# EAGLE schematic LFO-Complex (EAGLE 9.0.0)
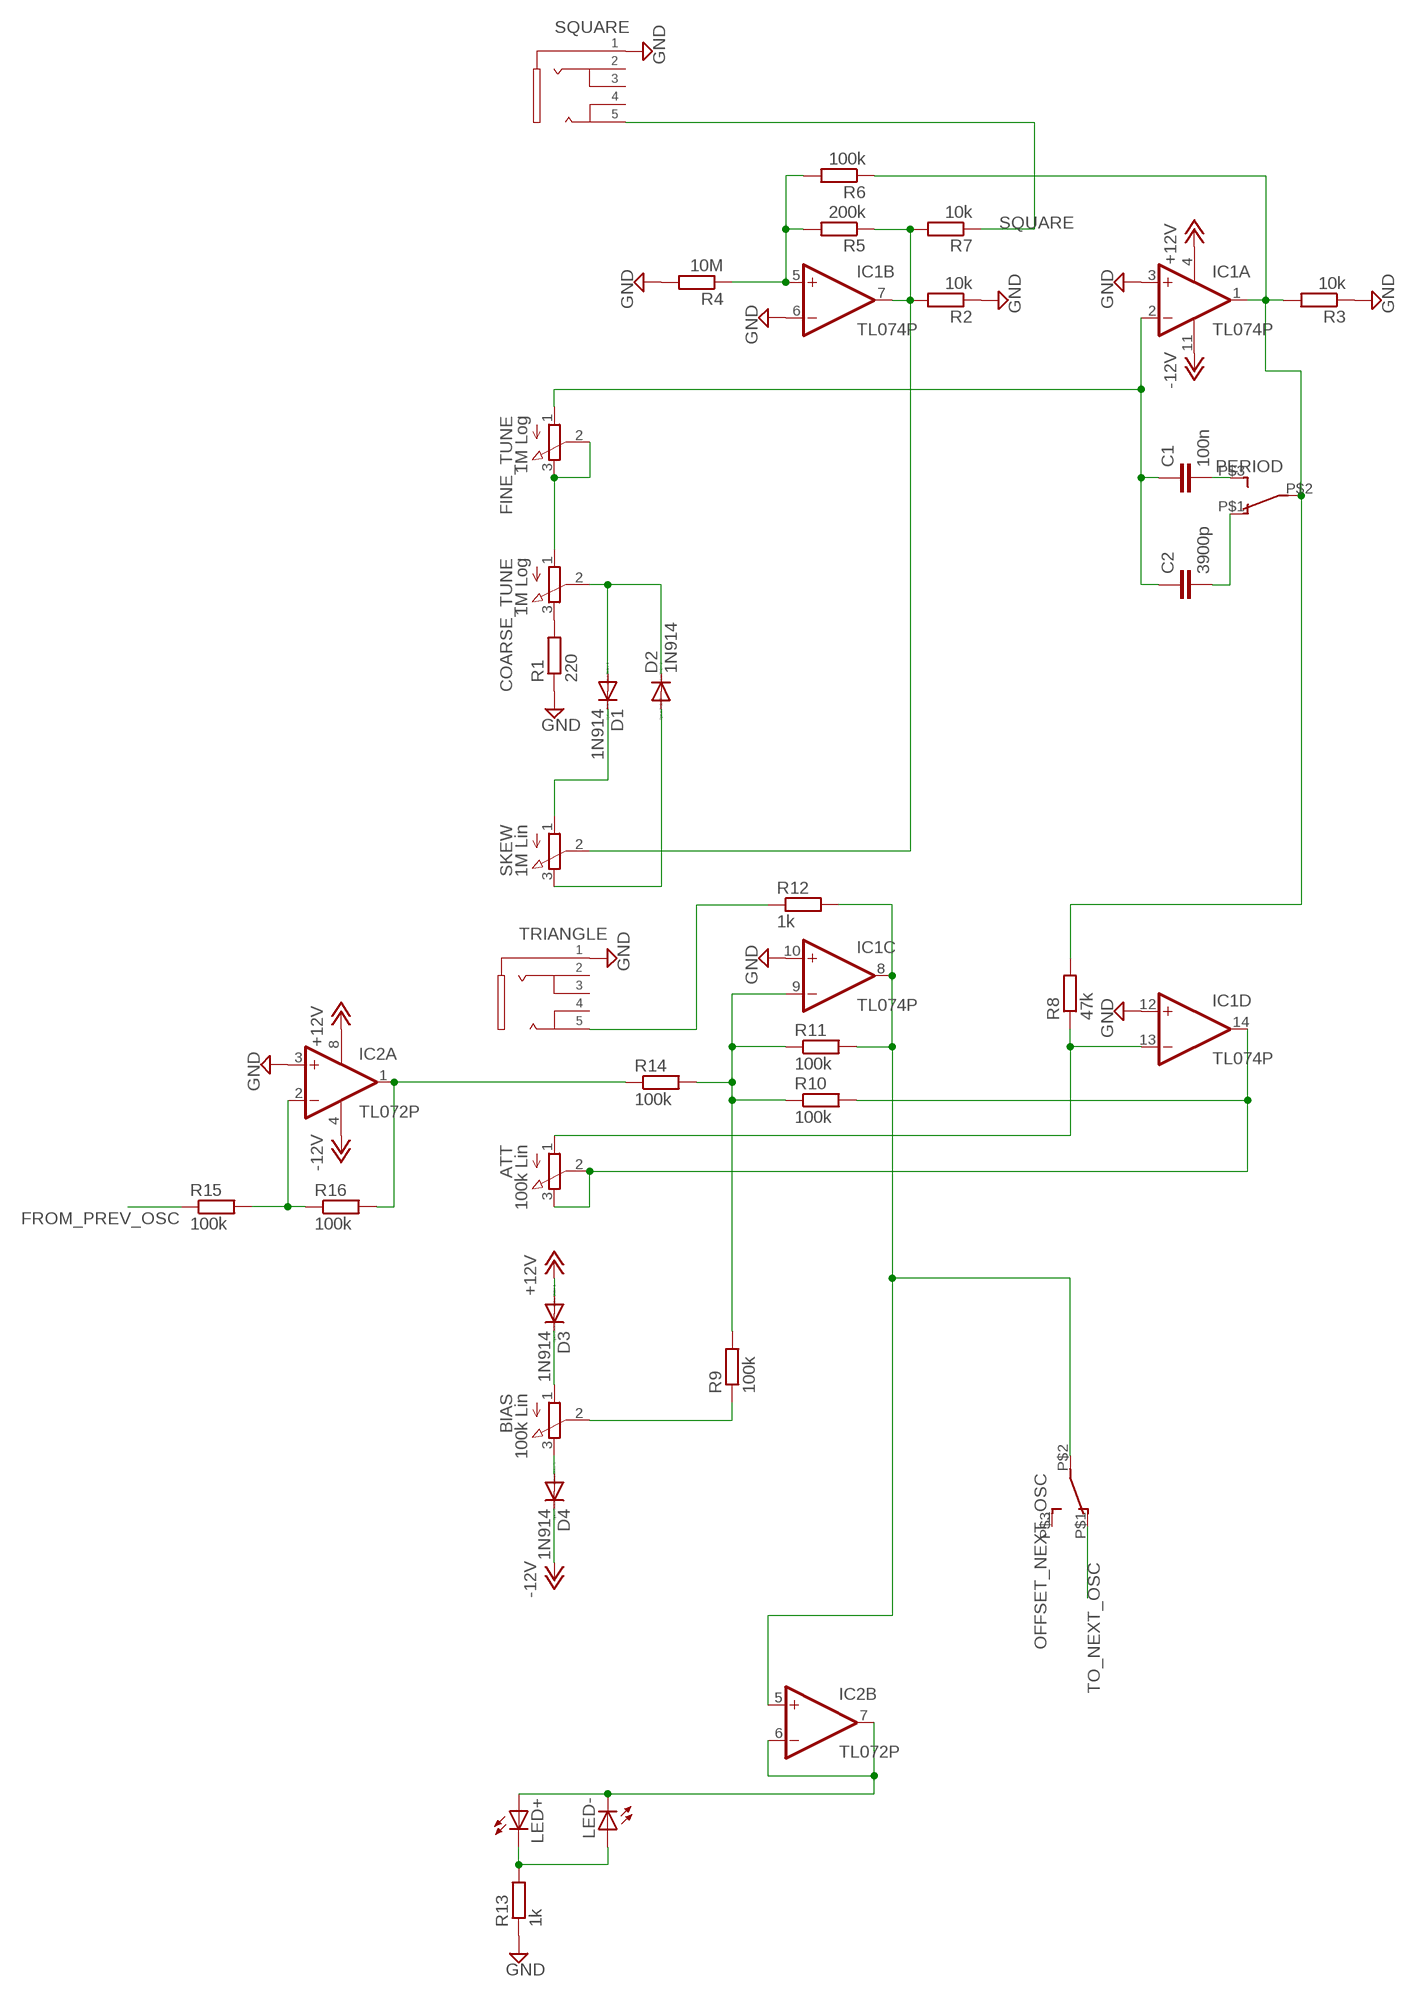
[diagram p0: schematic, sheet 1]

## Parts
ATT  100k Lin  3RP/1610N  [3RP/1610N]
BIAS  100k Lin  3RP/1610N  [3RP/1610N]
C1  100n  C-EU050-025X075  [C050-025X075]
C2  3900p  C-EU050-025X075  [C050-025X075]
COARSE_TUNE  1M Log  3RP/1610N  [3RP/1610N]
D1  1N914  [D-6.35]
D2  1N914  [D-6.35]
D3  1N914  [D-6.35]
D4  1N914  [D-6.35]
FINE_TUNE  1M Log  3RP/1610N  [3RP/1610N]
IC1  TL074P  [DIL14]
IC2  TL072P  [DIL08]
LED+  LED3MM-NB  [LED3MM]
LED-  LED3MM-NB  [LED3MM]
OFFSET_NEXT_OSC  TOGGLE-NB-MILLED  [TOGGLE-NB-MILLED]
PERIOD  TOGGLE-NB-MILLED  [TOGGLE-NB-MILLED]
R1  220  BOX-RESISTOR  [0204/7]
R2  10k  BOX-RESISTOR  [0204/7]
R3  10k  BOX-RESISTOR  [0204/7]
R4  10M  BOX-RESISTOR  [0204/7]
R5  200k  BOX-RESISTOR  [0204/7]
R6  100k  BOX-RESISTOR  [0204/7]
R7  10k  BOX-RESISTOR  [0204/7]
R8  47k  BOX-RESISTOR  [0204/7]
R9  100k  BOX-RESISTOR  [0204/7]
R10  100k  BOX-RESISTOR  [0204/7]
R11  100k  BOX-RESISTOR  [0204/7]
R12  1k  BOX-RESISTOR  [0204/7]
R13  1k  BOX-RESISTOR  [0204/7]
R14  100k  BOX-RESISTOR  [0204/7]
R15  100k  BOX-RESISTOR  [0204/7]
R16  100k  BOX-RESISTOR  [0204/7]
SKEW  1M Lin  3RP/1610N  [3RP/1610N]
SQUARE  PJ-324MH  [PJ-324MH]
TRIANGLE  PJ-324MH  [PJ-324MH]

## Nets
+12V: D3.A IC1.4(P:V+) IC2.8(P:V+)
-12V: D4.C IC1.11(P:V-) IC2.4(P:V-)
FROM_PREV_OSC: R15.1
GND: IC1.3(A:+IN) IC1.6(B:-IN) IC1.10(C:+IN) IC1.12(D:+IN) IC2.3(A:+IN) R1.1 R2.1 R3.1 R4.2 R13.1 SQUARE.1 TRIANGLE.1
N$1: COARSE_TUNE.1(A) FINE_TUNE.2(S) FINE_TUNE.3(E)
N$2: COARSE_TUNE.3(E) R1.2
N$3: COARSE_TUNE.2(S) D1.A D2.C
N$4: D1.C SKEW.1(A)
N$5: D2.A SKEW.3(E)
N$6: BIAS.1(A) D3.C
N$7: BIAS.3(E) D4.A
N$8: IC1.7(B:OUT) R2.2 R5.1 R7.2 SKEW.2(S)
N$9: C1.1 C2.1 FINE_TUNE.1(A) IC1.2(A:-IN)
N$10: IC1.1(A:OUT) PERIOD.P$2(P) R3.2 R6.1 R8.2
N$11: IC1.5(B:+IN) R4.1 R5.2 R6.2
N$12: C1.2 PERIOD.P$3(S)
N$13: C2.2 PERIOD.P$1(O)
N$14: ATT.1(A) IC1.13(D:-IN) R8.1
N$15: ATT.2(S) ATT.3(E) IC1.14(D:OUT) R10.2
N$16: BIAS.2(S) R9.1
N$17: IC1.9(C:-IN) R9.2 R10.1 R11.1 R14.2
N$18: IC1.8(C:OUT) IC2.5(B:+IN) OFFSET_NEXT_OSC.P$2(P) R11.2 R12.2
N$19: R12.1 TRIANGLE.5
N$20: IC2.2(A:-IN) R15.2 R16.1
N$21: IC2.1(A:OUT) R14.1 R16.2
N$22: IC2.6(B:-IN) IC2.7(B:OUT) LED+.A LED-.K(C)
N$23: LED+.K(C) LED-.A R13.2
SQUARE: R7.1 SQUARE.5
TO_NEXT_OSC: OFFSET_NEXT_OSC.P$1(O)
Unconnected: OFFSET_NEXT_OSC.P$3(S) SQUARE.2 SQUARE.3 SQUARE.4 TRIANGLE.2 TRIANGLE.3 TRIANGLE.4

## Library data of the parts
ATT BIAS COARSE_TUNE FINE_TUNE SKEW = pot:3RP/1610N: 16mm Potentiometer one level Source: http://www.alphapotentiometers.net/html/16mm_pot_2.html
C1 C2 = rcl:C-EU: CAPACITOR, European symbol; SPICEPREFIX: C
D1-D4 = toggle-nb:1N914
IC1 = linear:TL074: OP AMP
IC2 = linear:TL072: OP AMP
LED+ LED- = toggle-nb:LED3MM-NB
OFFSET_NEXT_OSC PERIOD = toggle-nb:TOGGLE-NB-MILLED
R1-R16 = toggle-nb:BOX-RESISTOR
SQUARE TRIANGLE = audio-jacks:PJ-324M

## Net classes
1 power: width 1.016 mm, clearance 0.203 mm